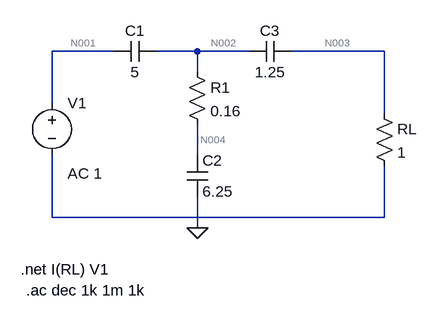
[diagram p0: schematic EJ_1A.asc]
EJ_1A.asc, the LTspice schematic file:
Version 4
SHEET 1 880 680
WIRE 48 128 -48 128
WIRE 176 128 112 128
WIRE 256 128 176 128
WIRE 464 128 320 128
WIRE 176 160 176 128
WIRE -48 208 -48 128
WIRE 464 224 464 128
WIRE 176 288 176 240
WIRE -48 384 -48 288
WIRE 464 384 464 304
WIRE 464 384 -48 384
WIRE 176 400 176 352
FLAG 176 400 0
SYMBOL cap 112 112 R90
WINDOW 0 0 32 VBottom 2
WINDOW 3 32 32 VTop 2
SYMATTR InstName C1
SYMATTR Value 5
SYMBOL res 160 144 R0
SYMATTR InstName R1
SYMATTR Value 0.16
SYMBOL cap 160 288 R0
SYMATTR InstName C2
SYMATTR Value 6.25
SYMBOL cap 320 112 R90
WINDOW 0 0 32 VBottom 2
WINDOW 3 32 32 VTop 2
SYMATTR InstName C3
SYMATTR Value 1.25
SYMBOL voltage -48 192 R0
WINDOW 123 24 124 Left 2
WINDOW 39 0 0 Left 0
SYMATTR Value2 AC 1
SYMATTR InstName V1
SYMATTR Value ""
SYMBOL res 448 208 R0
SYMATTR InstName RL
SYMATTR Value 1
TEXT -96 464 Left 2 !.net I(RL) V1
TEXT -88 496 Left 2 !.ac dec 1k 1m 1k

The netlist it stands for:
* EJ_1A.asc
C1 N002 N001 5
R1 N002 N004 0.16
C2 N004 0 6.25
C3 N003 N002 1.25
V1 N001 N005 AC 1
RL N003 N005 1
.net I(RL) V1
.ac dec 1k 1m 1k
.backanno
.end

* Results of the author's LTspice run, read from the files saved beside the schematic
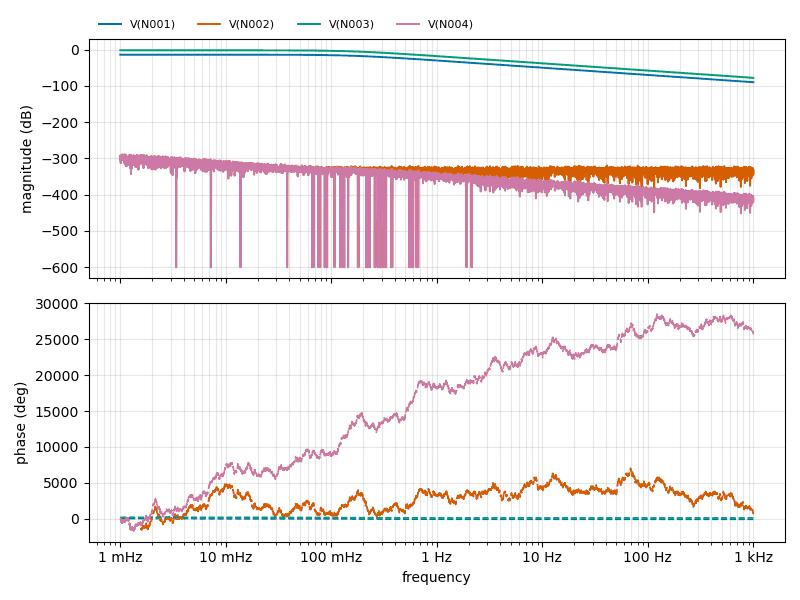
[diagram p1: AC Analysis of EJ_1A.asc, plotted from the saved traces]
* AC Analysis, 1 run:
*   V(N001): -13.98 dB at 1 mHz, -89.94 dB at 1 kHz, peak -13.98 dB at 1 mHz, 3 dB below the peak at 159.2 mHz
*   V(N002): -300.47 dB at 1 mHz, -340.63 dB at 1 kHz, peak -289.53 dB at 1.04 mHz, 3 dB below the peak at 1.037 mHz and 1.041 mHz
*   V(N003): -1.94 dB at 1 mHz, -77.90 dB at 1 kHz, peak -1.94 dB at 1 mHz, 3 dB below the peak at 159.2 mHz
*   V(N004): -300.47 dB at 1 mHz, -416.59 dB at 1 kHz, peak -289.53 dB at 1.04 mHz, 3 dB below the peak at 1.037 mHz and 1.041 mHz